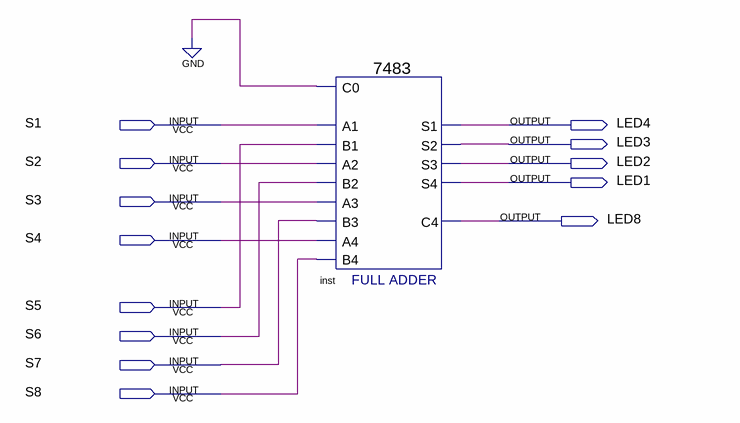
[diagram p0: schematic sheet]
// Quartus schematic Block2.bdf as structural Verilog: 1 symbols, 13 pins
module Block2 (
  input  S1,
  input  S2,
  input  S3,
  input  S4,
  input  S5,
  input  S6,
  input  S7,
  input  S8,
  output LED4,
  output LED3,
  output LED2,
  output LED1,
  output LED8
);

  \7483  inst (
    .B4(S8), .C0(1'b0), .A1(S1), .A2(S2), .B1(S5), .B2(S6), .A3(S3), .B3(S7), .A4(S4), .S3(LED2), .S4(LED1),
    .S2(LED3), .C4(LED8), .S1(LED4));
endmodule
